# Altium schematic sheet Sheet2.SchDoc
size A4; SheetNumber: 2; SheetTotal: 2
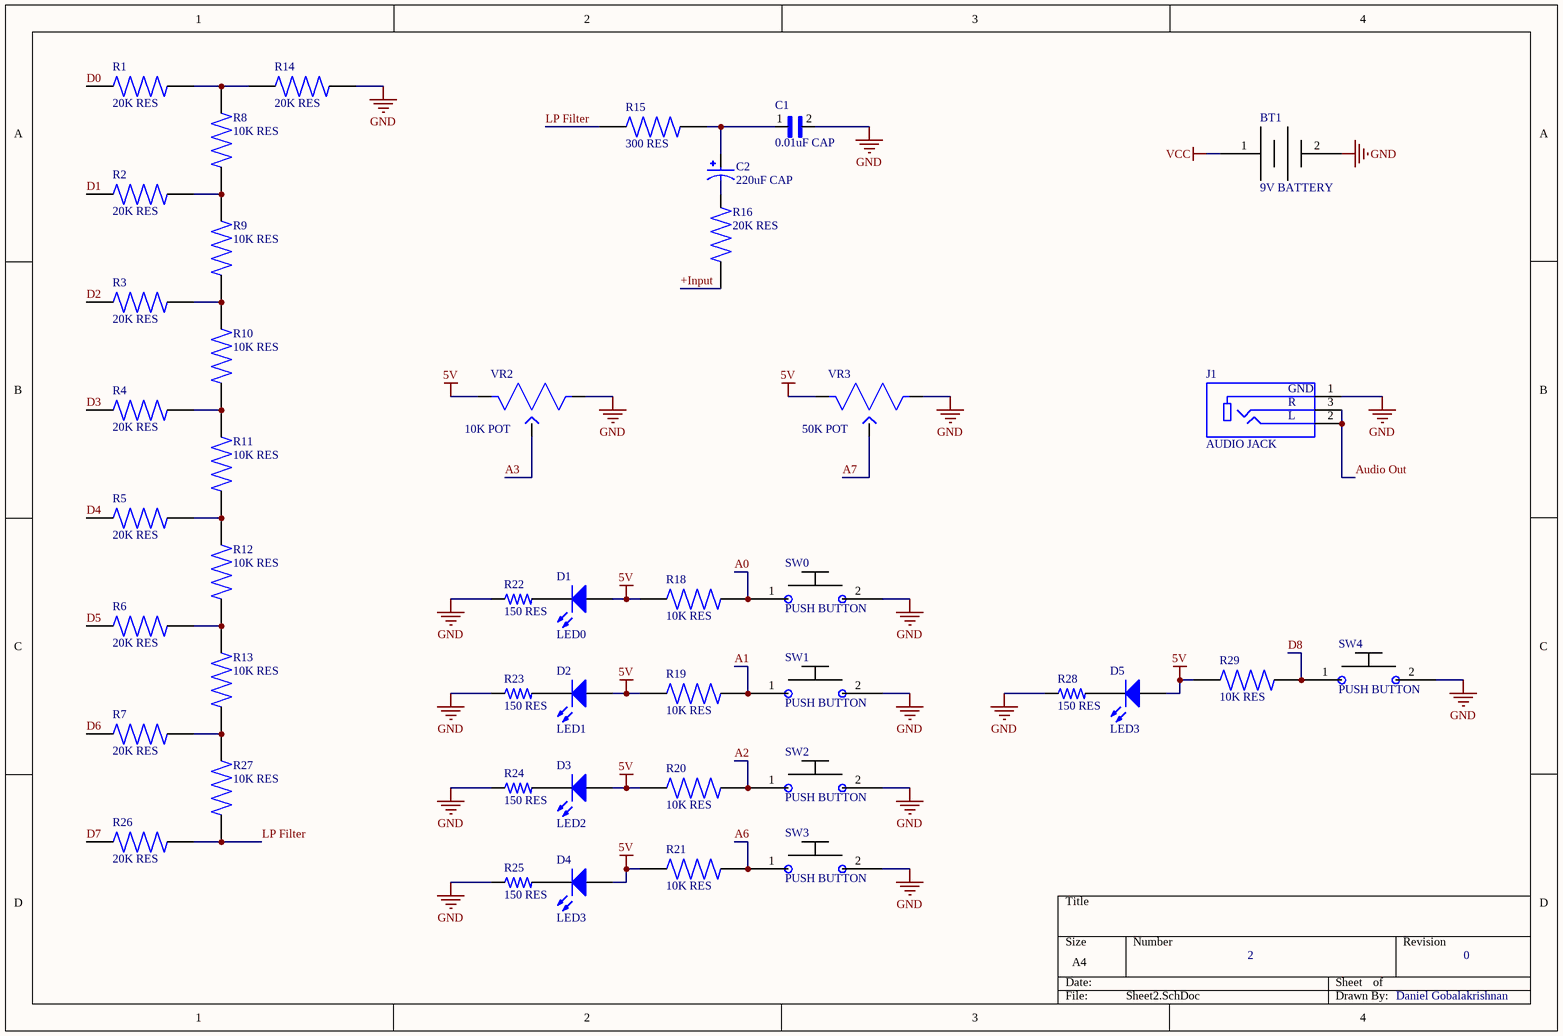
[diagram p0: Sheet2.SchDoc]

## Parts
BT1  9V BATTERY  [9V Battery]
C1  0.01uF CAP  [10uF CAP]
C2  220uF CAP  [220uF CAP]
D1  LED0  [LED-1]
D2  LED1  [LED-1]
D3  LED2  [LED-1]
D4  LED3  [LED-1]
D5  LED3  [LED-1]
J1  AUDIO JACK  [AUDIO JACK]
R1  20K RES  [20K RES]
R2  20K RES  [20K RES]
R3  20K RES  [20K RES]
R4  20K RES  [20K RES]
R5  20K RES  [20K RES]
R6  20K RES  [20K RES]
R7  20K RES  [20K RES]
R8  10K RES  [10K RES]
R9  10K RES  [10K RES]
R10  10K RES  [10K RES]
R11  10K RES  [10K RES]
R12  10K RES  [10K RES]
R13  10K RES  [10K RES]
R14  20K RES  [20K RES]
R15  300 RES  [300 RES]
R16  20K RES  [20K RES]
R18  10K RES  [10K RES]
R19  10K RES  [10K RES]
R20  10K RES  [10K RES]
R21  10K RES  [10K RES]
R22  150 RES  [150 RES]
R23  150 RES  [150 RES]
R24  150 RES  [150 RES]
R25  150 RES  [150 RES]
R26  20K RES  [20K RES]
R27  10K RES  [10K RES]
R28  150 RES  [150 RES]
R29  10K RES  [10K RES]
SW0  PUSH BUTTON  [Push Button]
SW1  PUSH BUTTON  [Push Button]
SW2  PUSH BUTTON  [Push Button]
SW3  PUSH BUTTON  [Push Button]
SW4  PUSH BUTTON  [Push Button]
VR2  10K POT  [10K POT]
VR3  50K POT  [50K POT]

## Nets
5V: D1.1(A) D2.1(A) D3.1(A) D4.1(A) D5.1(A) R18.2 R19.2 R20.2 R21.2 R29.2 VR2.1 VR3.1
GND: BT1.2 C1.2 J1.1 R14.2 R22.1 R23.1 R24.1 R25.1 R28.1 SW0.2 SW1.2 SW2.2 SW3.2 SW4.2 VR2.3 VR3.3
VCC: BT1.1
+Input: R16.2
A0: R18.1 SW0.1
A1: R19.1 SW1.1
A2: R20.1 SW2.1
A3: VR2.2
A6: R21.1 SW3.1
A7: VR3.2
Audio Out: J1.2 J1.3
D0: R1.1
D1: R2.1
D2: R3.1
D3: R4.1
D4: R5.1
D5: R6.1
D6: R7.1
D7: R26.1
D8: R29.1 SW4.1
LP Filter: R15.1 R26.2 R27.1
NetC1_1: C1.1 C2.P R15.2
NetC2_N: C2.N R16.1
NetD1_2: D1.2(K) R22.2
NetD2_2: D2.2(K) R23.2
NetD3_2: D3.2(K) R24.2
NetD4_2: D4.2(K) R25.2
NetD5_2: D5.2(K) R28.2
NetR1_2: R1.2 R8.2 R14.1
NetR2_2: R2.2 R8.1 R9.2
NetR3_2: R3.2 R9.1 R10.2
NetR4_2: R4.2 R10.1 R11.2
NetR5_2: R5.2 R11.1 R12.2
NetR6_2: R6.2 R12.1 R13.2
NetR7_2: R7.2 R13.1 R27.2

## Notes on the sheet
- 2
- 0
- Daniel Gobalakrishnan
- (in symbol AUDIO JACK) GND; R; L

## Library data of the parts
BT1 = 9V BATTERY: pin to pad: 12>1 13>2
C1 = 0.01uF CAP: Lead Capacitor E(JIS) with Capacitance: 1000pF and Rated Voltage: 400Vac(r.m.s.); MP: DE2E3SA102MN3AY02F; MF: Murata; Package: Radial Murata; SnapEDA_Link: https://www.snapeda.com/parts/DE2E3SA102MN3AY02F/Murata/view-part/4546572/?ref=snap; Digi-Key_Part_Number: 490-16237-1-ND; Mouser-Purchase-URL: https://snapeda.com/shop?store=Mouser&id=4546572; Value: *
C2 = 220uF CAP: 33ÂµF 250V Aluminum Electrolytic Capacitors Radial, Can 5000 Hrs @ 105Â°C; MP: UPM2E330MHD1TN; MF: Nichicon; Price: None; Availability: Warning; Package: Radial Nichicon; SnapEDA_Link: https://www.snapeda.com/parts/UPM2E330MHD1TN/Nichicon/view-part/2353634/?ref=snap; Check_prices: https://www.snapeda.com/parts/UPM2E330MHD1TN/Nichicon/view-part/2353634/?ref=eda; Value: *; Purchase-URL: https://pricing.snapeda.com/search/part/UPM2E330MHD1TN/?ref=eda
D1-D5 = LED1: Typical RED GaAs LED; Published: 8-Jun-2000; LatestRevisionDate: 08-Jul-2005; LatestRevisionNote: Mech Layer 1 removed.; PackageReference: LED-1; Publisher: Altium Limited; PackageDescription: LED; 2 Leads
J1 = AUDIO JACK: 3.5 mm, Stereo, Right Angle, Through Hole, Audio Jack Connector; MF: CUI Devices; MP: SJ1-3533N; Value: *; SnapEDA_Link: https://www.snapeda.com/parts/SJ1-3533N/CUI%20Devices/view-part/554489/?ref=snap; Price: None; Availability: Unavailable; CUI_purchase_URL: https://www.cuidevices.com/product/interconnect/connectors/audio-connectors/jacks/sj1-353xn-series?utm_source=snapeda.com&utm_medium=referral&utm_campaign=snapedaBOM; Package: None
R1-R7 R14 R16 R26 = 20K RES: MP: RMCF1206JT20K0; Package: None; Price: None; Value: *; Availability: Unavailable
R8-R13 R18-R21 R27 R29 = 10K RES: 10 kOhms Â±1% 0.25W, 1/4W Chip Resistor 1206 (3216 Metric) Automotive AEC-Q200 Thick Film; MP: RMCF1206FT10K0; MF: Stackpole Electronics Inc; Purchase-URL: https://pricing.snapeda.com/search/part/RMCF1206FT10K0/?ref=eda; SnapEDA_Link: https://www.snapeda.com/parts/RMCF1206FT10K0/Stackpole%20Electronics%20Inc/view-part/3955491/?ref=snap; Package: 3216 Stackpole; Check_prices: https://www.snapeda.com/parts/RMCF1206FT10K0/Stackpole%20Electronics%20Inc/view-part/3955491/?ref=eda; Digi-Key_Part_Number: RMCF1206FT10K0CT-ND; Value: *
R15 = 300 RES: CRCW Series 1206 0.25 W 300 Ohm Â±5 % Â±200 ppm/K SMT Thick Film Chip Resistor; MP: CRCW1206300RJNEA; Package: None; Price: None; Value: *; Availability: Unavailable
R22-R25 R28 = 150 RES: Through Hole Carbon Film Resistor, Cfr Series, 150 Ohm, 500 Mw, - 5%, 350 V, Axial Leaded; MF: TE Connectivity; MP: CFR50J150R; Availability: Good; Value: *; Package: Axial TE Connectivity; SnapEDA_Link: https://www.snapeda.com/parts/CFR50J150R/TE%20Connectivity/view-part/2667839/?ref=snap; Price: None; Check_prices: https://www.snapeda.com/parts/CFR50J150R/TE%20Connectivity/view-part/2667839/?ref=eda; Purchase-URL: https://pricing.snapeda.com/search/part/CFR50J150R/?ref=eda
VR2 = 10K POT: POT 10K OHM 1/10W PLASTIC LOG; MF: TT Electronics/BI; MP: P160KN-0QC15B500K; Value: *; Digi-Key_Part_Number: 987-1304-ND; Package: None; Digi-Key_Purchase_URL: https://www.digikey.cz/product-detail/en/tt-electronics-bi/P160KN-0QC15B500K/987-1304-ND/2408881?utm_source=snapeda&utm_medium=aggregator&utm_campaign=symbol; SnapEDA_Link: https://www.snapeda.com/parts/P160KN-0QC15B500K/TT%20Electronics/BI/view-part/903272/?ref=snap
VR3 = 50K POT: POT 50K OHM 1/5W PLASTIC LINEAR; MF: TT Electronics/BI; MP: P160KN-0QC15B500K; Value: *; Digi-Key_Part_Number: 987-1304-ND; Package: None; Digi-Key_Purchase_URL: https://www.digikey.cz/product-detail/en/tt-electronics-bi/P160KN-0QC15B500K/987-1304-ND/2408881?utm_source=snapeda&utm_medium=aggregator&utm_campaign=symbol; SnapEDA_Link: https://www.snapeda.com/parts/P160KN-0QC15B500K/TT%20Electronics/BI/view-part/903272/?ref=snap